# Altium schematic sheet LCR_2.SchDoc
size 282 x 208 mm; DRAWING_NAME: LCR; LAST_DATE_TIME: 22/09/30 10:23:00 PM; SHEET: 3; LAST_DATE_TIME: 22/09/30 10:23:00 PM; Organization: Altium Limited; Address1: L3, 12a Rodborough Rd; Address2: Frenchs Forest; Address3: NSW; Address4: Australia 2086; DRAWING_NAME: LCR; SHEET: 3; Origin: Eagle
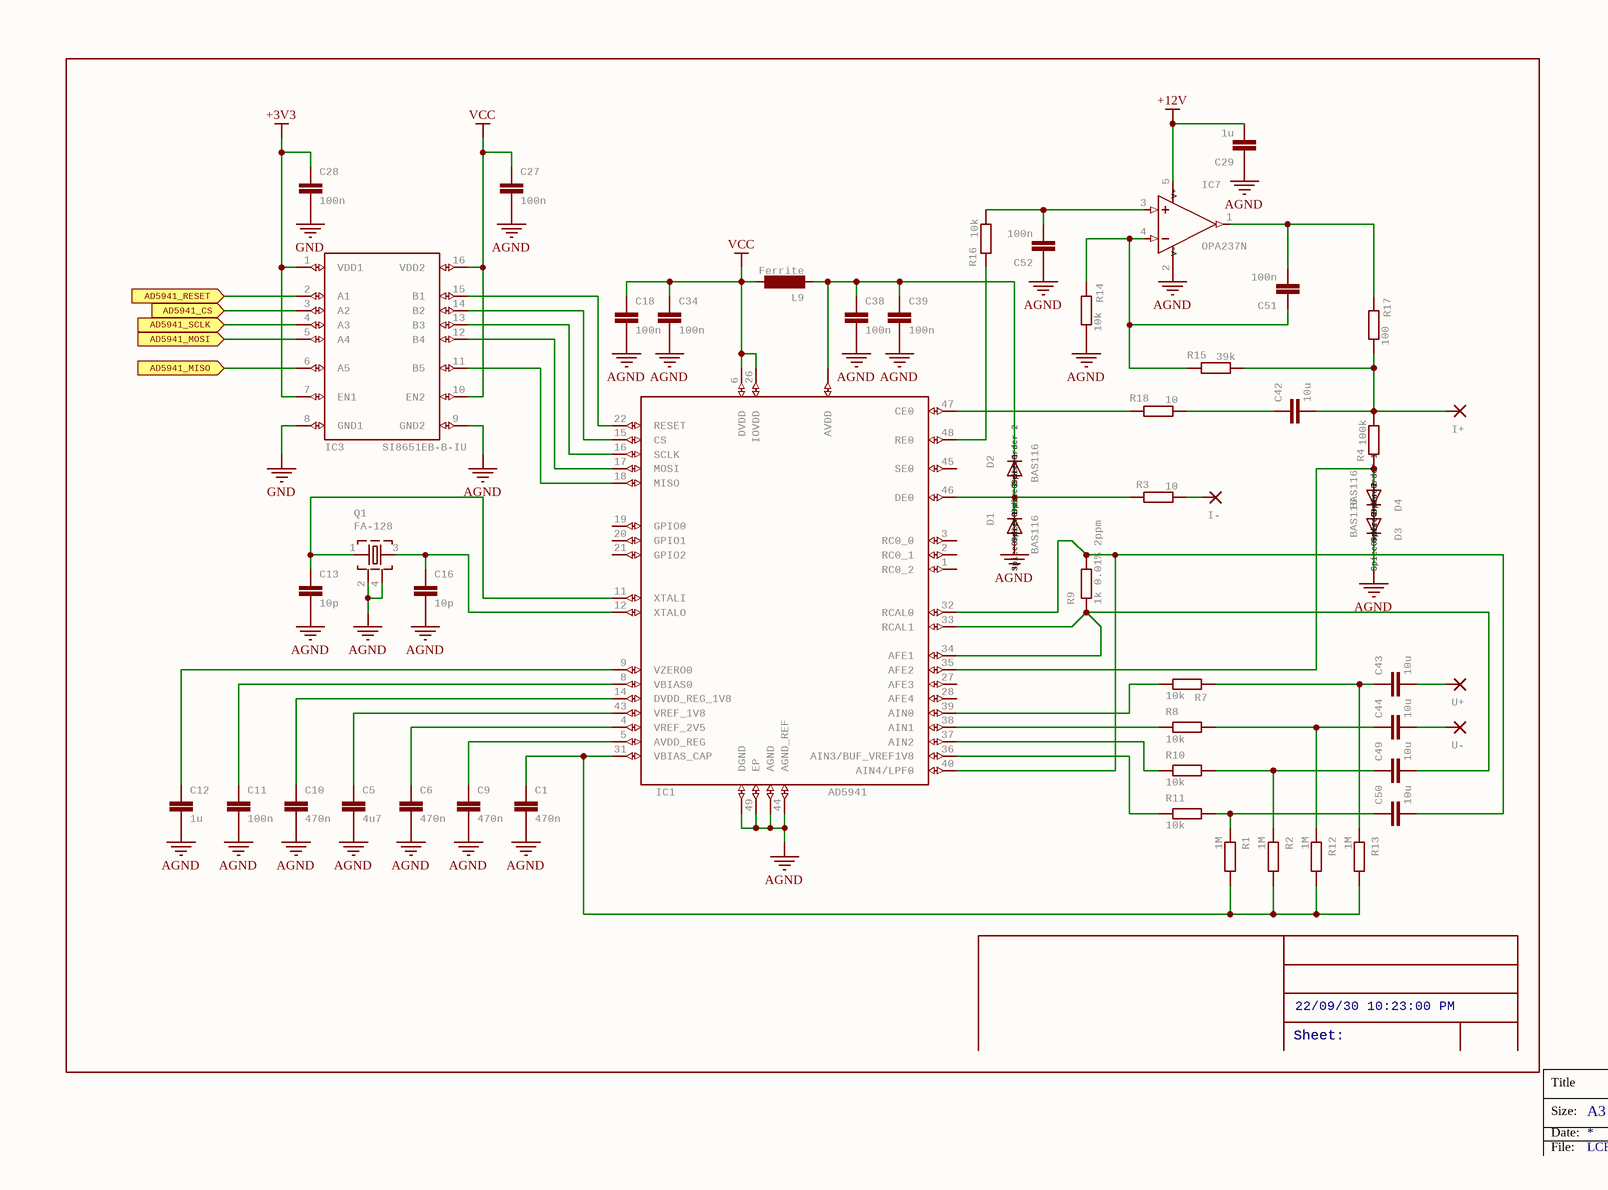
[diagram p0: LCR_2.SchDoc]

## Parts
C1  value 470n  [C0603K]
C5  value 4u7  [C0603K]
C6  value 470n  [C0603K]
C9  value 470n  [C0603K]
C10  value 470n  [C0603K]
C11  value 100n  [C0603K]
C12  value 1u  [C0603K]
C13  value 10p  [C0603K]
C16  value 10p  [C0603K]
C18  value 100n  [C0603K]
C27  value 100n  [C0603K]
C28  value 100n  [C0603K]
C29  value 1u  [C0603K]
C34  value 100n  [C0603K]
C38  value 100n  [C0603K]
C39  value 100n  [C0603K]
C42  value 10u  [C1206K]
C43  value 10u  [C1206K]
C44  value 10u  [C1206K]
C49  value 10u  [C1206K]
C50  value 10u  [C1206K]
C51  value 100n  [C0603K]
C52  value 100n  [C0603K]
D1  value BAS116  SpiceOrder1: SpiceOrder 1  SpiceOrder2: SpiceOrder 2  [SOD123]
D2  value BAS116  SpiceOrder1: SpiceOrder 1  SpiceOrder2: SpiceOrder 2  [SOD123]
D3  value BAS116  SpiceOrder1: SpiceOrder 1  SpiceOrder2: SpiceOrder 2  [SOD123]
D4  value BAS116  SpiceOrder1: SpiceOrder 1  SpiceOrder2: SpiceOrder 2  [SOD123]
I+  (no value)  [2,54/1,1]
I-  (no value)  [2,54/1,1]
IC1  AD5941  [QFN50P700X700X80-49T510N]
IC3  SI8651EB-B-IU  [SOP63P600X175-16N]
IC7  OPA237N  [SOT23-5]
L9  Ferrite  [R0603]
Q1  FA-128  [FA-128]
R1  value 1M  [R0603]
R2  value 1M  [R0603]
R3  value 10  [R0603]
R4  value 100k  [R0603]
R7  value 10k  [R0603]
R8  value 10k  [R0603]
R9  value 1k 0.01% 2ppm  [M0805]
R10  value 10k  [R0603]
R11  value 10k  [R0603]
R12  value 1M  [R0603]
R13  value 1M  [R0603]
R14  value 10k  [R0603]
R15  value 39k  [R0603]
R16  value 10k  [R0603]
R17  value 100  [R0603]
R18  value 10  [R0603]
U+  (no value)  [2,54/1,1]
U-  (no value)  [2,54/1,1]

## Ports
AD5941_CS (in), AD5941_MISO (in), AD5941_MOSI (in), AD5941_RESET (in), AD5941_SCLK (in)

## Nets
+3V3: C28.1 IC3.1(VDD1) IC3.7(EN1)
+12V: C29.2 IC7.5(V+)
AGND: C1.2 C5.2 C6.2 C9.2 C10.2 C11.2 C12.2 C13.2 C16.2 C18.2 C27.2 C29.1 C34.2 C38.2 C39.2 C52.1 D1.A D3.C IC1.13_23_25(DGND) IC1.29_42(AGND) IC1.44(AGND_REF) IC1.49(EP) IC3.9(GND2) IC7.2(V-) Q1.2 Q1.4 R14.1
GND: C28.2 IC3.8(GND1)
VCC: C18.1 C27.1 C34.1 IC1.6(DVDD) IC1.26(IOVDD) IC3.10(EN2) IC3.16(VDD2) L9.1
AD5941_CS: IC3.3(A2) ; port AD5941_CS
AD5941_MISO: IC3.6(A5) ; port AD5941_MISO
AD5941_MOSI: IC3.5(A4) ; port AD5941_MOSI
AD5941_RESET: IC3.2(A1) ; port AD5941_RESET
AD5941_SCLK: IC3.4(A3) ; port AD5941_SCLK
NetC1_1: C1.1 IC1.31(VBIAS_CAP) R1.2 R2.2 R12.2 R13.2
NetC5_1: C5.1 IC1.43(VREF_1V8)
NetC6_1: C6.1 IC1.4(VREF_2V5)
NetC9_1: C9.1 IC1.5(AVDD_REG)
NetC10_1: C10.1 IC1.14(DVDD_REG_1V8)
NetC11_1: C11.1 IC1.8(VBIAS0)
NetC12_1: C12.1 IC1.9(VZERO0)
NetC13_1: C13.1 IC1.11(XTALI) Q1.1
NetC16_1: C16.1 IC1.12(XTALO) Q1.3
NetC38_1: C38.1 C39.1 D2.C IC1.30_41(AVDD) L9.2
NetC42_1: C42.1 R18.1
NetC42_2: C42.2 I+.1(P) R4.1 R15.1 R17.1
NetC43_1: C43.1 R7.2 R13.1
NetC43_2: C43.2 U+.1(P)
NetC44_1: C44.1 R8.2 R12.1
NetC44_2: C44.2 U-.1(P)
NetC49_1: C49.1 R2.1 R10.2
NetC49_2: C49.2 IC1.33(RCAL1) IC1.34(AFE1) R9.1
NetC50_1: C50.1 R1.1 R11.2
NetC50_2: C50.2 D4.A IC1.32(RCAL0) IC1.35(AFE2) IC1.40(AIN4/LPF0) R4.2 R9.2
NetC51_1: C51.1 IC7.4(-IN) R14.2 R15.2
NetC51_2: C51.2 IC7.1(OUT) R17.2
NetC52_2: C52.2 IC7.3(+IN) R16.1
NetD1_C: D1.C D2.A IC1.46(DE0) R3.2
NetD3_A: D3.A D4.C
NetI-_1: I-.1(P) R3.1
NetIC1_15: IC1.15(CS) IC3.14(B2)
NetIC1_16: IC1.16(SCLK) IC3.13(B3)
NetIC1_17: IC1.17(MOSI) IC3.12(B4)
NetIC1_18: IC1.18(MISO) IC3.11(B5)
NetIC1_22: IC1.22(RESET) IC3.15(B1)
NetIC1_36: IC1.36(AIN3/BUF_VREF1V8) R11.1
NetIC1_37: IC1.37(AIN2) R10.1
NetIC1_38: IC1.38(AIN1) R8.1
NetIC1_39: IC1.39(AIN0) R7.1
NetIC1_47: IC1.47(CE0) R18.2
NetIC1_48: IC1.48(RE0) R16.2

Not connected (* = marked no-connect by the designer): IC1 1(RC0_2) 2(RC0_1) 3(RC0_0) 19(GPIO0) 20(GPIO1) 21(GPIO2) 27(AFE3) 28(AFE4) 45(SE0)

## Notes on the sheet
- Sheet:
- 22/09/30 10:23:00 PM
- Title
- Size:
- Date:
- A3
- Number:
- Time:
- Revision:
- Sheet
- of
- RayaBonyanLotus
- File:

## Library data of the parts
C1 C5 C6 C9-C13 C16 C18 C27-C29 C34 C38 C39 C51 C52 = C-EUC0603K: CAPACITOR, European symbol; GateName_1: G$1; SymbolName_1: C-EU; DeviceName: C0603K; LibraryName: rcl; DeviceSetName: C-EU
C42-C44 C49 C50 = C-EUC1206K: CAPACITOR, European symbol; GateName_1: G$1; SymbolName_1: C-EU-1; DeviceSetName: C-EU; DeviceName: C1206K; LibraryName: resistor
D1-D4 = DIODE-SOD123: DIODE; GateName_1: G$1; SymbolName_1: D; DeviceSetName: DIODE-; DeviceName: SOD123; LibraryName: diode
I+ I- U+ U- = 2,54/1,1: THROUGH-HOLE PAD; GateName_1: 1; SymbolName_1: PAD; LibraryName: wirepad; DeviceSetName: 2,54/1,1; VALUE: 2,54/1,1
IC1 = AD5941: GateName_1: G$1; SymbolName_1: AD5941; LibraryName: custom-ic; DeviceSetName: AD5941
IC3 = SI8651EB-B-IU: GateName_1: G$1; SymbolName_1: SI8651; DeviceName: EB-B-IU; LibraryName: custom-ic; DeviceSetName: SI8651
IC7 = OPA237N: Operational Amplifiers   Single-Supply, MicroAmplifier(TM) Series; MPN: OPA237NA/250; GateName_1: G$1; SymbolName_1: OP-AMP+-; DeviceName: N; DeviceSetName: OPA237; MF: TEXAS INSTRUMENTS; LibraryName: burr-brown; V+: V+; V-: V-; OC_FARNELL: 4625298; OC_NEWARK: 35C1874
L9 = INDUCTOR0603: GateName_1: G$1; SymbolName_1: L-EU; DeviceName: 0603; LibraryName: rf; DeviceSetName: INDUCTOR
Q1 = FA-128: MHz RANGE CRYSTAL UNIT    Source: Epson Toyocom; GateName_1: G$1; SymbolName_1: Q-SHIELD2; DeviceName: 128; DeviceSetName: FA-; LibraryName: crystal
R1-R4 R7 R8 R10-R18 = R-EU_R0603: RESISTOR, European symbol; GateName_1: G$1; SymbolName_1: R-EU; DeviceSetName: R-EU_; DeviceName: R0603; LibraryName: rcl
R9 = R-EU_M0805: RESISTOR, European symbol; GateName_1: G$1; SymbolName_1: R-EU-1; DeviceSetName: R-EU_; DeviceName: M0805; LibraryName: resistor